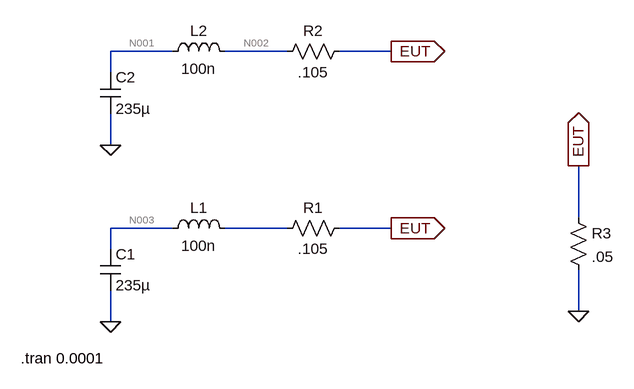
[diagram p0: schematic 8x20 - Two Capacitor.asc]
8x20 - Two Capacitor.asc, the LTspice schematic file:
Version 4
SHEET 1 880 680
WIRE 144 -176 48 -176
WIRE 320 -176 224 -176
WIRE 480 -176 400 -176
WIRE 48 -144 48 -176
WIRE 48 -32 48 -80
WIRE 768 80 768 0
WIRE 144 96 48 96
WIRE 320 96 224 96
WIRE 480 96 400 96
WIRE 48 128 48 96
WIRE 768 224 768 160
WIRE 48 240 48 192
FLAG 48 240 0
FLAG 480 96 EUT
IOPIN 480 96 Out
FLAG 768 0 EUT
IOPIN 768 0 Out
FLAG 768 224 0
FLAG 48 -32 0
FLAG 480 -176 EUT
IOPIN 480 -176 Out
SYMBOL cap 32 128 R0
SYMATTR InstName C1
SYMATTR Value 235µ
SYMATTR SpiceLine IC=5000
SYMBOL ind 128 112 R270
WINDOW 0 32 56 VTop 2
WINDOW 3 5 56 VBottom 2
SYMATTR InstName L1
SYMATTR Value 100n
SYMBOL res 416 80 R90
WINDOW 0 0 56 VBottom 2
WINDOW 3 32 56 VTop 2
SYMATTR InstName R1
SYMATTR Value .105
SYMBOL res 752 64 R0
SYMATTR InstName R3
SYMATTR Value .05
SYMBOL cap 32 -144 R0
SYMATTR InstName C2
SYMATTR Value 235µ
SYMATTR SpiceLine IC=5000
SYMBOL ind 128 -160 R270
WINDOW 0 32 56 VTop 2
WINDOW 3 5 56 VBottom 2
SYMATTR InstName L2
SYMATTR Value 100n
SYMBOL res 416 -192 R90
WINDOW 0 0 56 VBottom 2
WINDOW 3 32 56 VTop 2
SYMATTR InstName R2
SYMATTR Value .105
TEXT -90 296 Left 2 !.tran 0.0001

The netlist it stands for:
* 8x20 - Two Capacitor.asc
C1 N003 0 235µ IC=5000
L1 N003 N004 100n
R1 EUT N004 .105
R3 EUT 0 .05
C2 N001 0 235µ IC=5000
L2 N001 N002 100n
R2 EUT N002 .105
.tran 0.0001
.backanno
.end

* Results of the author's LTspice run, read from the files saved beside the schematic
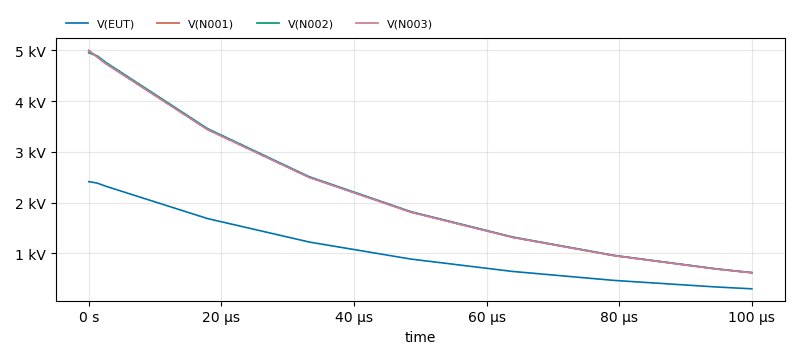
[diagram p1: Transient Analysis of 8x20 - Two Capacitor.asc, plotted from the saved traces]
* Transient Analysis, 1 run:
*   V(EUT): min 304.3 V, max 2.415 kV, average 1.037 kV, rms 1.208 kV, last 304.3 V
*   V(N001): min 620.5 V, max 5 kV, average 2.115 kV, rms 2.465 kV, last 620.5 V
*   V(N002): min 623.8 V, max 4.952 kV, average 2.126 kV, rms 2.477 kV, last 623.8 V
*   V(N003): min 620.5 V, max 5 kV, average 2.115 kV, rms 2.465 kV, last 620.5 V